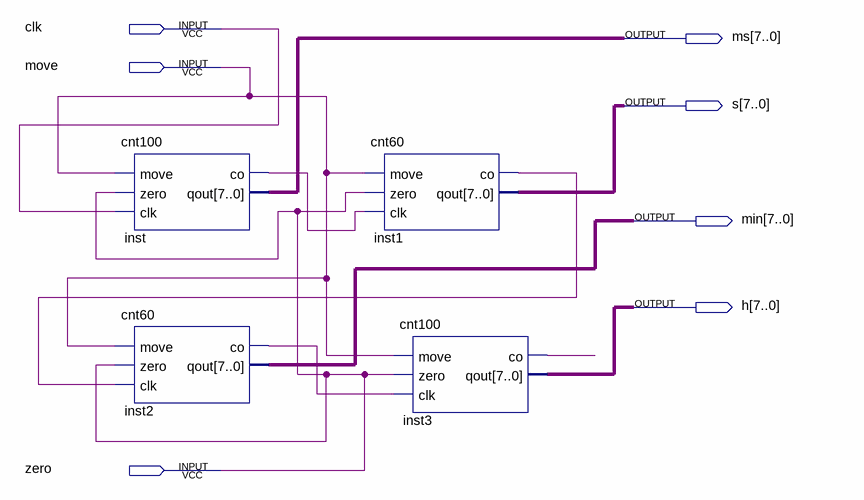
[diagram p0: schematic sheet]
// Quartus schematic number.bdf as structural Verilog: 4 symbols, 7 pins
module number (
  input  clk,
  input  move,
  input  zero,
  output [7:0] ms,
  output [7:0] s,
  output [7:0] min,
  output [7:0] h
);

  wire inst1_co, inst2_co, inst3_co, inst_co;

  cnt100 inst (.move(move), .zero(zero), .clk(clk), .co(inst_co), .qout(ms));
  cnt60 inst2 (.move(move), .zero(zero), .clk(inst1_co), .co(inst2_co), .qout(min));
  cnt60 inst1 (.move(move), .zero(zero), .clk(inst_co), .co(inst1_co), .qout(s));
  cnt100 inst3 (.move(move), .zero(zero), .clk(inst2_co), .co(inst3_co), .qout(h));
endmodule
